# Altium schematic sheet Connection.SchDoc
size A4
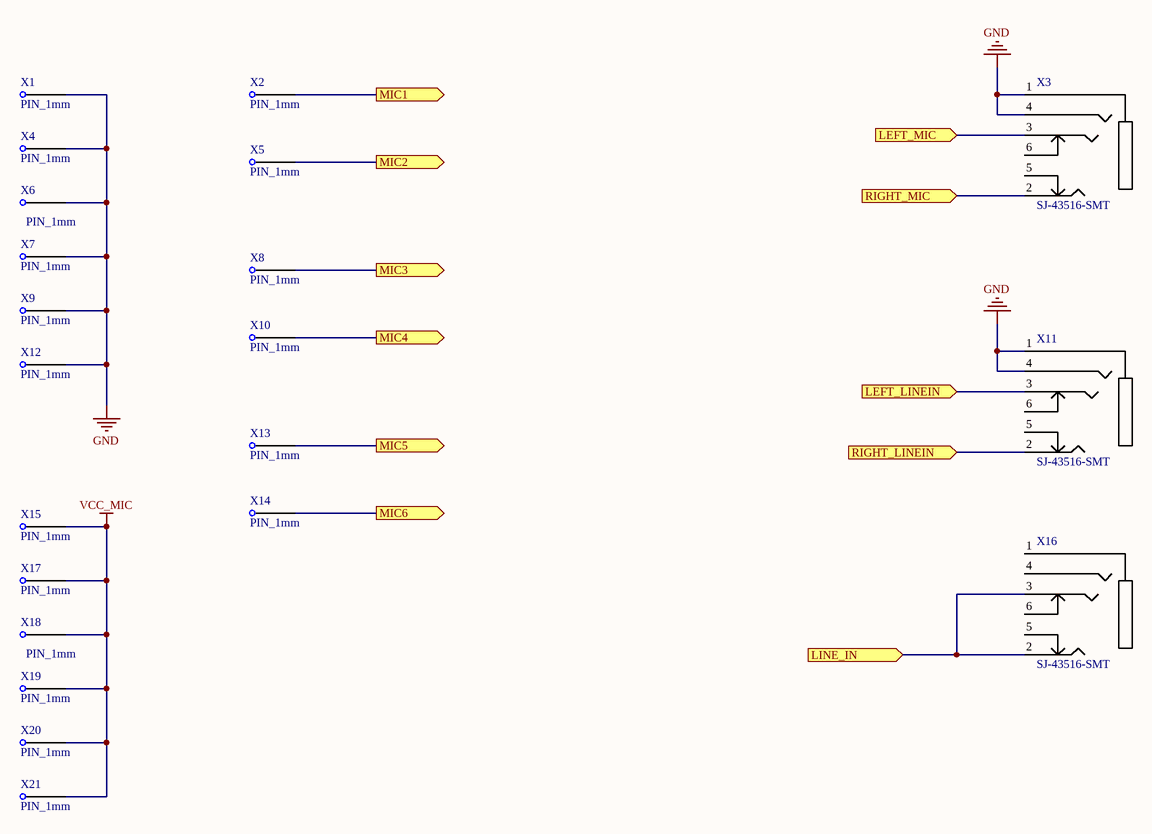
[diagram p0: Connection.SchDoc]

## Parts
X1  PIN_1mm  [PIN_1mm]
X2  PIN_1mm  [PIN_1mm]
X3  SJ-43516-SMT  [SJ-43516-SMT]
X4  PIN_1mm  [PIN_1mm]
X5  PIN_1mm  [PIN_1mm]
X6  PIN_1mm  [PIN_1mm]
X7  PIN_1mm  [PIN_1mm]
X8  PIN_1mm  [PIN_1mm]
X9  PIN_1mm  [PIN_1mm]
X10  PIN_1mm  [PIN_1mm]
X11  SJ-43516-SMT  [SJ-43516-SMT]
X12  PIN_1mm  [PIN_1mm]
X13  PIN_1mm  [PIN_1mm]
X14  PIN_1mm  [PIN_1mm]
X15  PIN_1mm  [PIN_1mm]
X16  SJ-43516-SMT  [SJ-43516-SMT]
X17  PIN_1mm  [PIN_1mm]
X18  PIN_1mm  [PIN_1mm]
X19  PIN_1mm  [PIN_1mm]
X20  PIN_1mm  [PIN_1mm]
X21  PIN_1mm  [PIN_1mm]

## Ports
LEFT_LINEIN (in), LEFT_MIC (in), LINE_IN (in), MIC1 (out), MIC2 (out), MIC3 (out), MIC4 (out), MIC5 (out), MIC6 (out), RIGHT_LINEIN (in), RIGHT_MIC (in)

## Nets
GND: X1.1 X3.1 X3.4 X4.1 X6.1 X7.1 X9.1 X11.1 X11.4 X12.1
VCC_MIC: X15.1 X17.1 X18.1 X19.1 X20.1 X21.1
LEFT_LINEIN: X11.3 ; port LEFT_LINEIN
LEFT_MIC: X3.3 ; port LEFT_MIC
LINE_IN: X16.2 X16.3 ; port LINE_IN
MIC1: X2.1 ; port MIC1
MIC2: X5.1 ; port MIC2
MIC3: X8.1 ; port MIC3
MIC4: X10.1 ; port MIC4
MIC5: X13.1 ; port MIC5
MIC6: X14.1 ; port MIC6
RIGHT_LINEIN: X11.2 ; port RIGHT_LINEIN
RIGHT_MIC: X3.2 ; port RIGHT_MIC

Not connected (* = marked no-connect by the designer): X3 5 6; X11 5 6; X16 1 4 5 6

## Library data of the parts
X3 X11 X16 = SJ-43516-SMT: 3.5mm connector 4 conductors